# EAGLE design pulseandbloom (EAGLE 7.6.0)
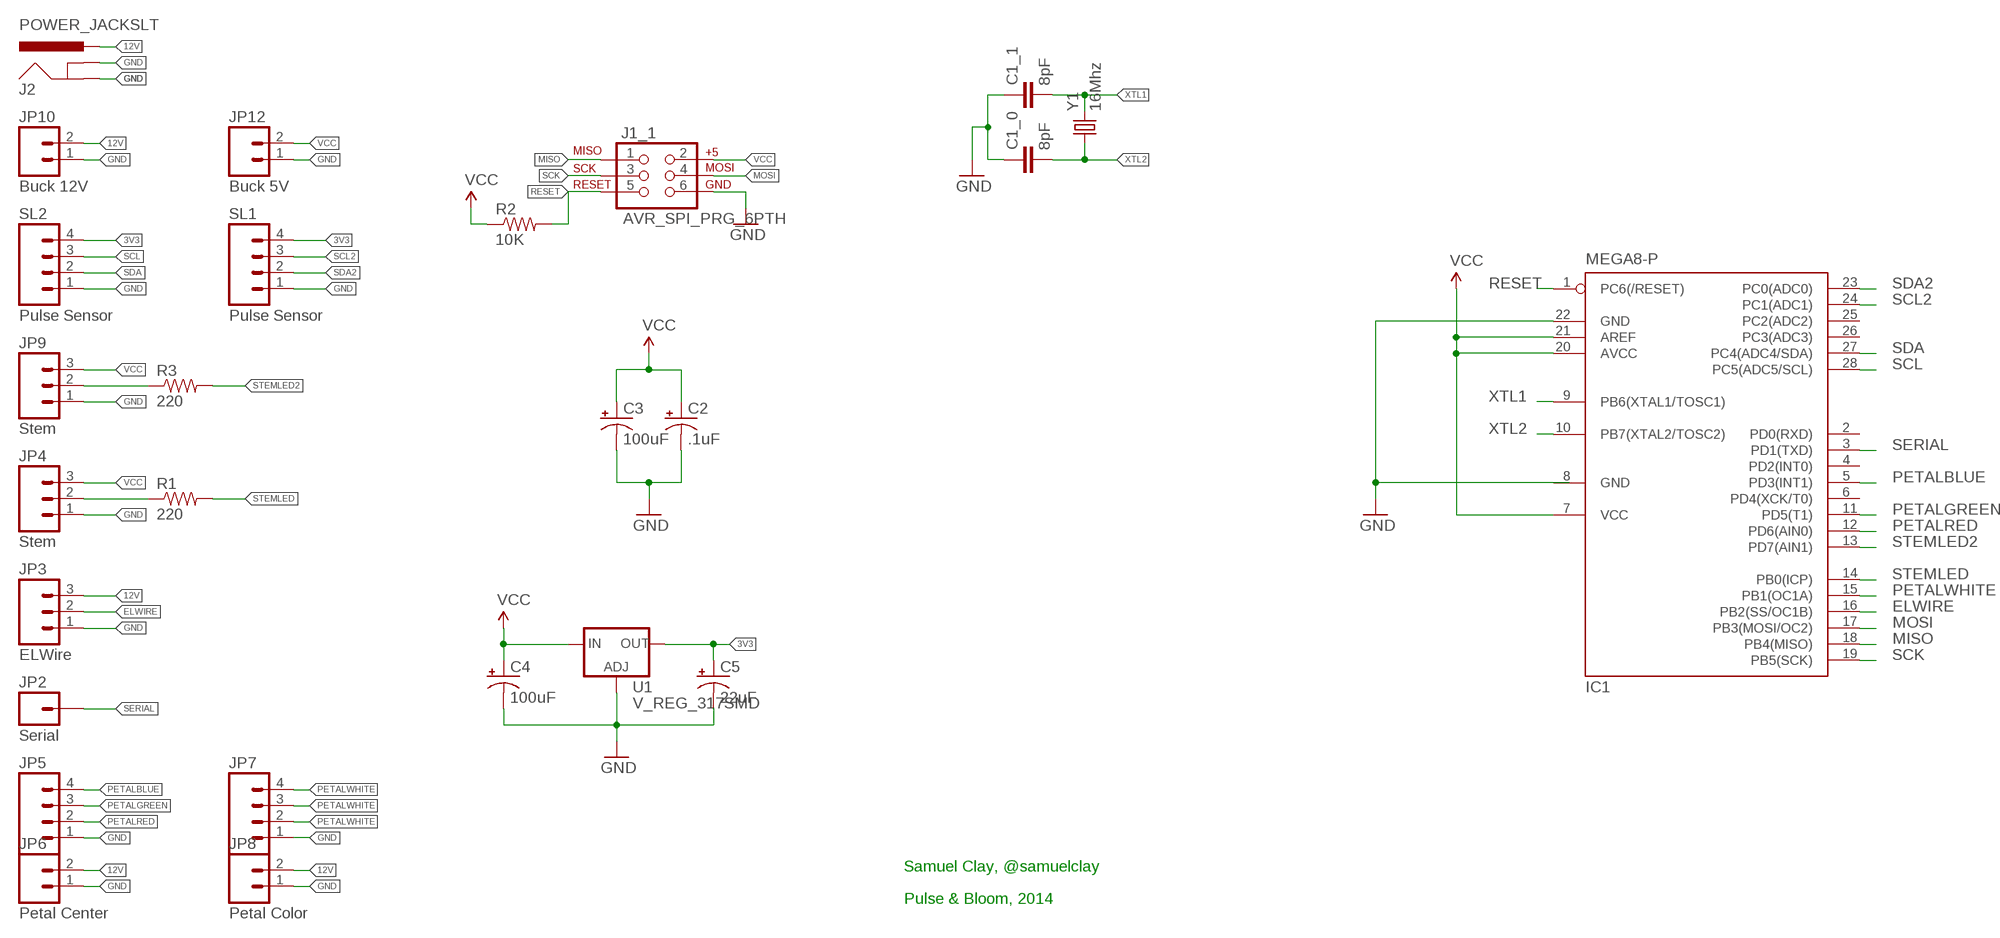
[diagram p0: schematic, sheet 1]

## Parts
C1_0  8pF  CAPPTH1  [CAP-PTH-5MM]
C1_1  8pF  CAPPTH1  [CAP-PTH-5MM]
C2  .1uF  CAP_POLPTH2  [CPOL-RADIAL-10UF-25V]
C3  100uF  CAP_POLPTH1  [CPOL-RADIAL-100UF-25V]
C4  100uF  CAP_POLPTH1  [CPOL-RADIAL-100UF-25V]
C5  22uF  CAP_POLPTH1  [CPOL-RADIAL-100UF-25V]
IC1  MEGA8-P  [DIL28-3]
J1_1  AVR_SPI_PRG_6PTH  [2X3]
J2  POWER_JACKSLT  [POWER_JACK_SLOT]
JP2  Serial  M01PTH  [1X01]
JP3  ELWire  M03POLAR_LOCK  [MOLEX-1X3_LOCK]
JP4  Stem  M03POLAR_LOCK  [MOLEX-1X3_LOCK]
JP5  M04POLAR_LOCK  [MOLEX-1X4_LOCK]
JP6  Petal Center  M023.5MM_LOCK  [SCREWTERMINAL-3.5MM-2_LOCK]
JP7  M04POLAR  [MOLEX-1X4]
JP8  Petal Color  M023.5MM_LOCK  [SCREWTERMINAL-3.5MM-2_LOCK]
JP9  Stem  M03POLAR_LOCK  [MOLEX-1X3_LOCK]
JP10  Buck 12V  M023.5MM_LOCK  [SCREWTERMINAL-3.5MM-2_LOCK]
JP12  Buck 5V  M023.5MM_LOCK  [SCREWTERMINAL-3.5MM-2_LOCK]
R1  220  RESISTORPTH-1/4W  [AXIAL-0.4]
R2  10K  RESISTORPTH-1/4W  [AXIAL-0.4]
R3  220  RESISTORPTH-1/4W  [AXIAL-0.4]
SL1  Pulse Sensor  M04POLAR_LOCK  [MOLEX-1X4_LOCK]
SL2  Pulse Sensor  M04POLAR_LOCK  [MOLEX-1X4_LOCK]
U1  V_REG_317SMD  [SOT223]
Y1  16Mhz  CRYSTALHC49US  [HC49US]

## Nets
3V3: C5.1(+) SL1.4 SL2.4 U1.2(OUT)
12V: J2.PWR JP3.3 JP6.2 JP8.2 JP10.2
ELWIRE: IC1.16(PB2(SS/OC1B)) JP3.2
GND: C1_0.1 C1_1.1 C2.2(-) C3.2(-) C4.2(-) C5.2(-) IC1.22(GND) J1_1.6 J2.GND@1(GNDBREAK) J2.GND@2(GND) JP3.1 JP4.1 JP5.1 JP6.1 JP7.1 JP8.1 JP9.1 JP10.1 JP12.1 SL1.1 SL2.1 U1.1(ADJ)
MISO: IC1.18(PB4(MISO)) J1_1.1
MOSI: IC1.17(PB3(MOSI/OC2)) J1_1.4
N$1: JP9.2 R3.P$1
N$7: JP4.2 R1.P$1
PETALBLUE: IC1.5(PD3(INT1)) JP5.4
PETALGREEN: IC1.11(PD5(T1)) JP5.3
PETALRED: IC1.12(PD6(AIN0)) JP5.2
PETALWHITE: IC1.15(PB1(OC1A)) JP7.2 JP7.3 JP7.4
RESET: IC1.1(PC6(/RESET)) J1_1.5 R2.P$2
SCK: IC1.19(PB5(SCK)) J1_1.3
SCL: IC1.28(PC5(ADC5/SCL)) SL2.3
SCL2: IC1.24(PC1(ADC1)) SL1.3
SDA: IC1.27(PC4(ADC4/SDA)) SL2.2
SDA2: IC1.23(PC0(ADC0)) SL1.2
SERIAL: IC1.3(PD1(TXD)) JP2.1
STEMLED: IC1.14(PB0(ICP)) R1.P$2
STEMLED2: IC1.13(PD7(AIN1)) R3.P$2
VCC: C2.1(+) C3.1(+) C4.1(+) IC1.7(VCC) IC1.20(AVCC) IC1.21(AREF) J1_1.2 JP4.3 JP9.3 JP12.2 R2.P$1 U1.3(IN)
XTL1: C1_1.2 IC1.9(PB6(XTAL1/TOSC1)) Y1.2
XTL2: C1_0.2 IC1.10(PB7(XTAL2/TOSC2)) Y1.1
Unconnected: IC1.2(PD0(RXD)) IC1.4(PD2(INT0)) IC1.6(PD4(XCK/T0)) IC1.25(PC2(ADC2)) IC1.26(PC3(ADC3))

## Notes on the sheet
- Samuel Clay, @samuelclay
- Pulse & Bloom, 2014

## Power pins joined to a net without a drawn wire
GND: IC1.8(GND)

## Library data of the parts
C1_0 C1_1 = SparkFun-Capacitors:CAP: Capacitor Standard 0603 ceramic capacitor, and 0.1" leaded capacitor.
C2-C5 = SparkFun-Capacitors:CAP_POL: Capacitor Polarized These are standard SMD and PTH capacitors. Normally 10uF, 47uF, and 100uF in electrolytic and tantalum varieties. Always verify the external diameter of the through hole cap, it varies with capacity, voltage, and manufacturer. The EIA devices should be standard.
IC1 = atmel:MEGA8-P: MICROCONTROLLER 8 Kbytes FLASH, 1 kbytes SRAM, 512 bytes EEPROM, USART, 4-channel 10 bit ADC, 2-channel 8 bit ADC Pin compatible with Atmega48, ATMega88, ATMega168 Source: avr.lbr; OC_FARNELL: unknown; OC_NEWARK: unknown
J1_1 = SparkFun-Connectors:AVR_SPI_PRG_6: AVR ISP 6 Pin This is the reduced ISP connector for AVR programming. Common on Arduino. This footprint will take up less PCB space and can be used with a 10-pin to 6-pin adapter such as SKU: BOB-08508 **Special note about "TEST_POINT" package. The stop mask is on the top side, so if you want your programming test points to be on the bottom of your board, make sure to place this package on the bottom side of the board. This also ensure that the orientation to program from the bottom side will be correct.
J2 = SparkFun-Connectors:POWER_JACK: Power Jack This is the standard 5.5mm barrel jack for power. The PTH is the most common, proven, reliable, footprint. The Slot footprint only works if the mill layer is transmitted to the PCB fab house so be warned. Mating wall wart : TOL-00298 (and others); PROD_ID: PRT-00119
JP2 = SparkFun-Connectors:M01: Header 1 Standard 1-pin 0.1" header. Use with straight break away headers (SKU : PRT-00116), right angle break away headers (PRT-00553), swiss pins (PRT-00743), machine pins (PRT-00117), and female headers (PRT-00115).
JP3 JP4 JP9 = SparkFun-Connectors:M03: Header 3 Standard 3-pin 0.1" header. Use with straight break away headers (SKU : PRT-00116), right angle break away headers (PRT-00553), swiss pins (PRT-00743), machine pins (PRT-00117), and female headers (PRT-00115). Molex polarized connector foot print use with SKU : PRT-08232 with associated crimp pins and housings.
JP5 JP7 SL1 SL2 = SparkFun-Connectors:M04: Header 4 Standard 4-pin 0.1" header. Use with straight break away headers (SKU : PRT-00116), right angle break away headers (PRT-00553), swiss pins (PRT-00743), machine pins (PRT-00117), and female headers (PRT-00115). Molex polarized connector foot print use with SKU : PRT-08231 with associated crimp pins and housings. 1MM SMD Version SKU: PRT-10208
JP6 JP8 JP10 JP12 = SparkFun-Connectors:M02: Standard 2-pin 0.1" header. Use with - straight break away headers ( PRT-00116) - right angle break away headers (PRT-00553) - swiss pins (PRT-00743) - machine pins (PRT-00117) - female headers (PRT-00115) Molex polarized connector foot print use with: PRT-08233 with associated crimp pins and housings. 2.54_SCREWTERM for use with PRT-10571. 3.5mm Screw Terminal footprints for PRT-08084 5mm Screw Terminal footprints for use with PRT-08433
R1-R3 = SparkFun-Passives:RESISTOR: Resistor Basic schematic elements and footprints for 0603, 1206, and PTH resistors.
U1 = SparkFun-PowerIC:V_REG_317: Voltage Regulator Standard LM317 adjustable voltage regulator. AOI (Adjust Output Input). Google 'LM317 Calculator' for easy to use app to get the two resistor values needed. 240/720 for 5V output. 240/390 for 3.3V output. Spark Fun Electronics SKU : COM-00527
Y1 = SparkFun-FreqCtrl:CRYSTAL: Various standard crystals. Proven footprints.

## Board
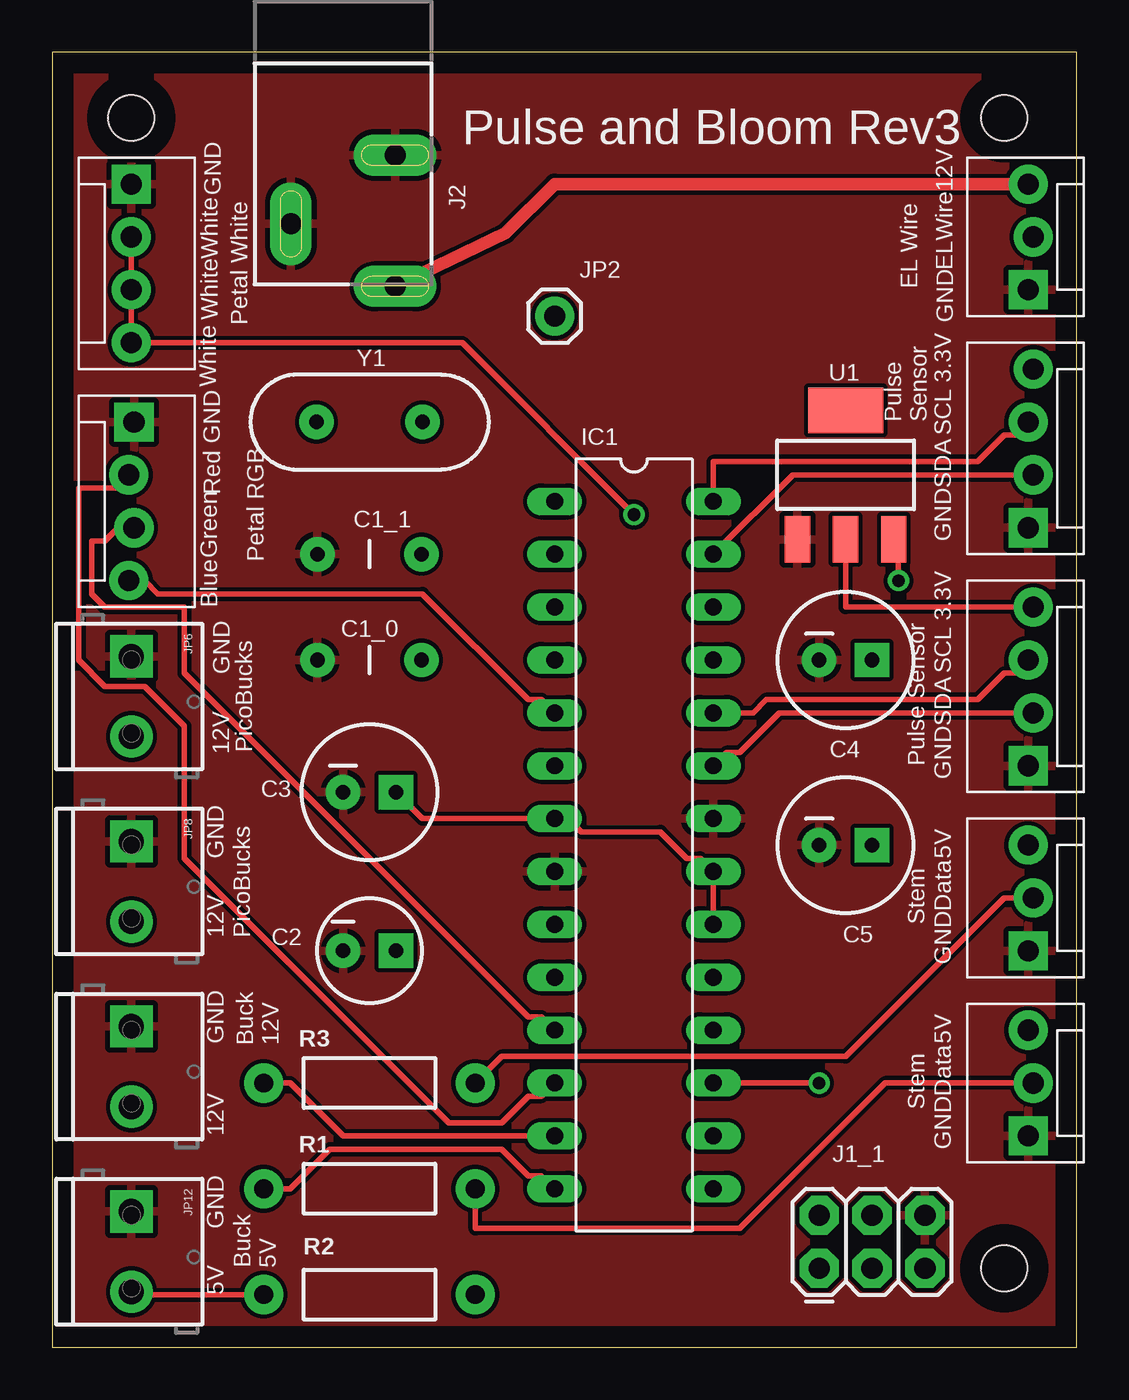
[diagram p1: board, top side]
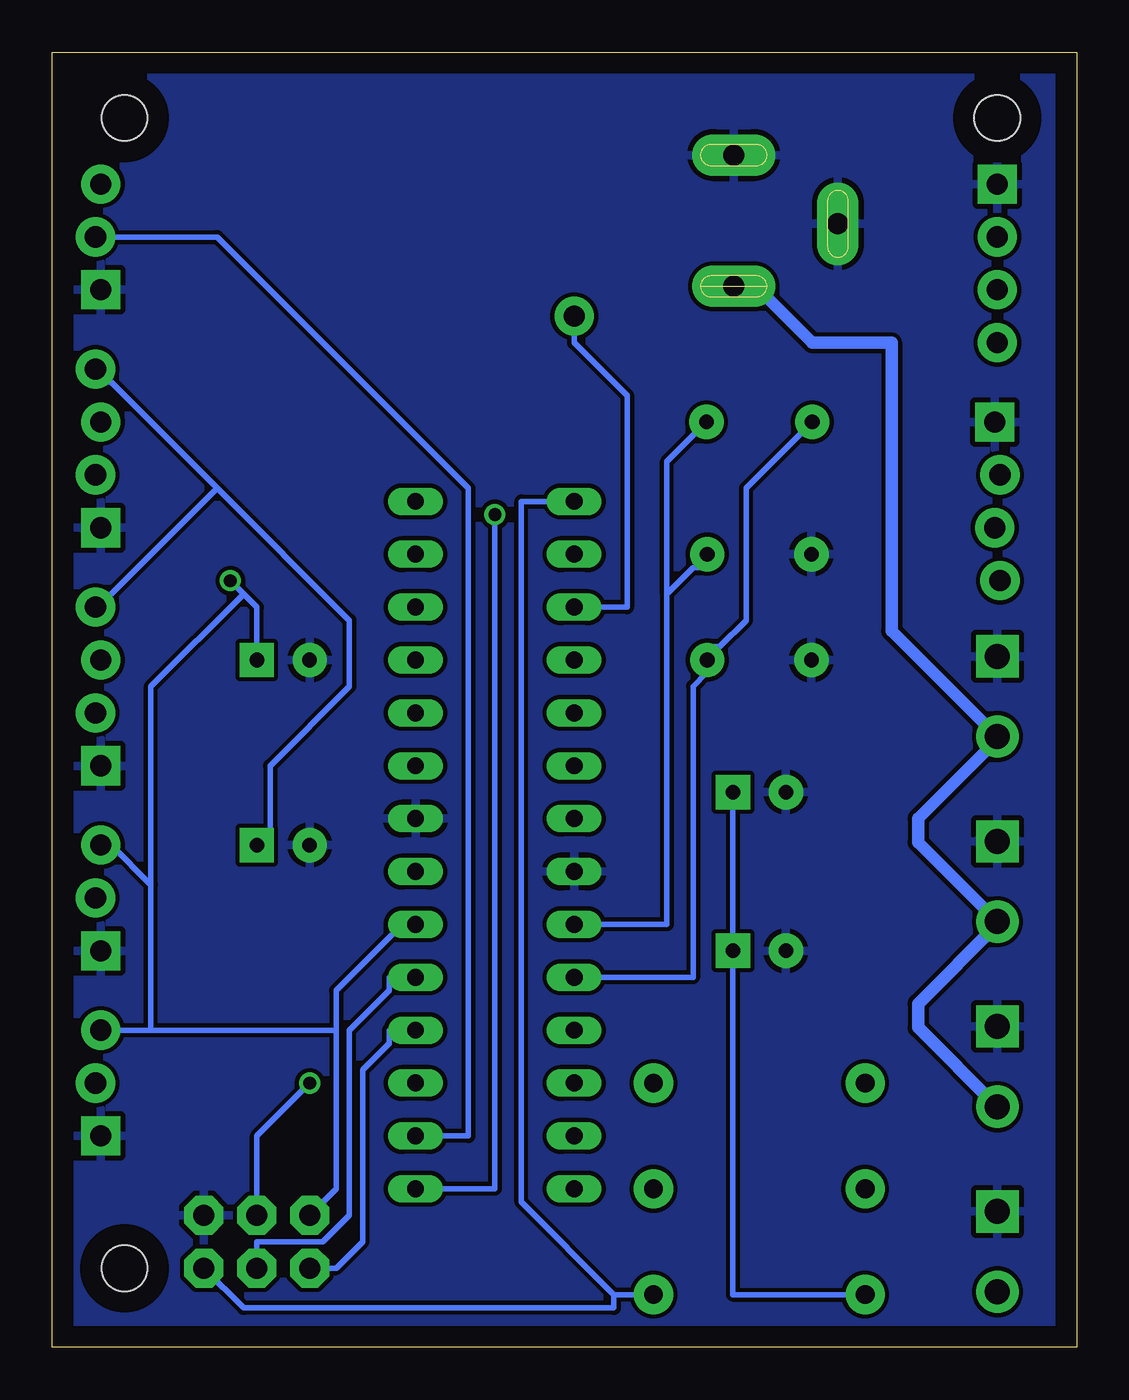
[diagram p2: board, bottom side, seen from below]

Size 49.2 x 62.22 mm. Coordinates in mm from the lower left corner, seen from the top.
Outline: 0,0 49.2,0 49.2,62.22 0,62.22 0,0
Copper layers (1*16): Top 0.035mm / dielectric 1.5mm / Bottom 0.035mm
Design rules "default": minimum track width 10mil, minimum drill 24mil, track to track 8mil, track to pad 8mil, pad to pad 8mil, via to via 8mil, smd to smd 8mil, copper to edge 40mil, drill to drill 8mil, minimum pad ring 10mil, minimum via ring 8mil, stop-mask expansion 4mil, vias tented up to drill 0mil, thermal gap 10mil
Holes 2.2 mm at 45.72,3.81 3.81,59.05 45.72,59.05

### Footprints (pad centres in the part's own frame; a part is rotated, then mirrored left to right if it is on the bottom)
CAP-PTH-5MM = drill 0.7 pad 1.651: 1 -2.5,0; 2 2.5,0
CPOL-RADIAL-10UF-25V = drill 0.7 pad 1.651 square: 1 1.27,0 | drill 0.7 pad 1.651: 2 -1.27,0
CPOL-RADIAL-100UF-25V = drill 0.7 pad 1.651 square: 1 1.27,0 | drill 0.7 pad 1.651: 2 -1.27,0
DIL28-3 = drill 0.813 long: 1 -16.51,-3.81; 2 -13.97,-3.81; 3 -11.43,-3.81; 4 -8.89,-3.81; 5 -6.35,-3.81; 6 -3.81,-3.81; 7 -1.27,-3.81; 8 1.27,-3.81; 9 3.81,-3.81; 10 6.35,-3.81; 11 8.89,-3.81; 12 11.43,-3.81; 13 13.97,-3.81; 14 16.51,-3.81; 15 16.51,3.81; 16 13.97,3.81; 17 11.43,3.81; 18 8.89,3.81; 19 6.35,3.81; 20 3.81,3.81; 21 1.27,3.81; 22 -1.27,3.81; 23 -3.81,3.81; 24 -6.35,3.81; 25 -8.89,3.81; 26 -11.43,3.81; 27 -13.97,3.81; 28 -16.51,3.81
2X3 = drill 1.016 pad 1.88 octagon: 1 0,0; 2 0,2.54; 3 2.54,0; 4 2.54,2.54; 5 5.08,0; 6 5.08,2.54
POWER_JACK_SLOT = drill 1 pad 2 long: GND@1 2.58,7.5; GND@2 7.58,10.8; PWR 2.58,13.8
1X01 = drill 1.016 pad 1.88: 1 0,0
MOLEX-1X3_LOCK = drill 1.016 pad 1.88 square: 1 0,0.127 | drill 1.016 pad 1.88: 2 2.54,-0.127; 3 5.08,0.127
MOLEX-1X4_LOCK = drill 1.016 pad 1.88 square: 1 0,0.127 | drill 1.016 pad 1.88: 2 2.54,-0.127; 3 5.08,0.127; 4 7.62,-0.127
SCREWTERMINAL-3.5MM-2_LOCK = drill 1.2 pad 2.032 square: 1 -0.178,0 | drill 1.2 pad 2.032: 2 3.678,0
MOLEX-1X4 = drill 1.016 pad 1.88 square: 1 0,0 | drill 1.016 pad 1.88: 2 2.54,0; 3 5.08,0; 4 7.62,0
AXIAL-0.4 = drill 0.9 pad 1.88: P$1 -5.08,0; P$2 5.08,0
SOT223 = smd 1.219 x 2.235: 1 -2.311,-3.099; 2 0,-3.099; 3 2.311,-3.099 | smd 3.6 x 2.2: 4 0,3.099
HC49US = drill 0.7 pad 1.651: 1 -2.54,0; 2 2.54,0

### Placement (x,y rotation side)
C1_0  15.24,33.02 0 top
C1_1  15.24,38.1 0 top
C2  15.24,19.05 0 top
C3  15.24,26.67 0 top
C4  38.1,33.02 0 top
C5  38.1,24.13 0 top
IC1  27.94,24.13 270 top
J1_1  36.83,3.81 0 top
J2  19.05,64.77 180 top
JP2  24.13,49.53 0 top
JP3  46.99,50.8 90 top
JP4  46.99,10.16 90 top
JP5  3.81,44.45 270 top
JP6  3.81,33.02 270 top
JP7  3.81,55.88 270 top
JP8  3.81,24.13 270 top
JP9  46.99,19.05 90 top
JP10  3.81,15.24 270 top
JP12  3.81,6.35 270 top
R1  15.24,7.62 180 top
R2  15.24,2.54 0 top
R3  15.24,12.7 180 top
SL1  46.99,27.94 90 top
SL2  46.99,39.37 90 top
U1  38.1,41.91 0 top
Y1  15.24,44.45 0 top

### Tracks (layer width: path | path; a pad name or v marks a point on that pad's centre or on a via)
3V3
  Top 0.254: U1.2 38.1,35.56 SL1.4
  Bottom 0.254: C5.1 38.73,24.77 38.73,27.94 34.92,31.75 34.92,34.92 41.27,41.27 | 41.27,41.27 46.35,46.35 46.99,46.35 46.99,46.99 SL2.4 | 41.27,41.27 46.99,35.56 SL1.4
12V
  Top 0.61: J2.PWR 21.76,53.51 24.13,55.88 JP3.3
  Bottom 0.61: JP10.2 7.62,15.37 7.62,16.51 3.81,20.32 JP8.2 7.62,24.26 7.62,25.4 3.81,29.21 JP6.2 8.89,34.42 8.89,48.26 12.7,48.26 15.41,50.97 J2.PWR
ELWIRE
  Bottom 0.254: IC1.16 29.21,10.16 29.21,41.27 41.27,53.34 JP3.2
GND
  pour Bottom: -7.32,68.76 54.68,68.76 54.68,67.76 54.68,-6.24 -6.32,-6.24 -6.32,-5.24 -7.32,-5.24
  pour Top: -3.32,66.76 52.68,66.76 52.68,61.76 52.68,-4.24 -3.32,-4.24 -3.32,-3.24
MISO
  Bottom 0.254: IC1.18 33.02,15.24 33.02,14.6 34.29,13.33 34.29,5.08 35.56,3.81 J1_1.1
MOSI  (via drill 0.61)
  Top 0.254: v36.83,12.7 IC1.17
  Bottom 0.254: v36.83,12.7 39.37,10.16 J1_1.4
N$1
  Top 0.254: R3.P$1 21.59,13.97 38.1,13.97 45.72,21.59 JP9.2
N$7
  Top 0.254: R1.P$1 20.32,5.71 33.02,5.71 40.01,12.7 JP4.2
PETALBLUE
  Top 0.254: IC1.5 23.49,31.11 22.86,31.11 17.78,36.2 5.08,36.2 4.45,36.83 JP5.4
PETALGREEN
  Top 0.254: IC1.11 23.49,15.87 22.86,15.87 6.35,32.38 6.35,35.56 2.54,35.56 1.91,36.2 1.91,38.73 2.54,38.73 3.18,39.37 JP5.3
PETALRED
  Top 0.254: IC1.12 23.49,12.06 22.86,12.06 21.59,10.79 19.05,10.79 6.35,23.49 6.35,29.84 4.45,31.75 2.54,31.75 1.27,33.02 1.27,41.27 3.18,41.27 3.81,41.91 JP5.2
PETALWHITE  (via drill 0.61)
  Top 0.254: JP7.2 JP7.3 JP7.4 19.69,48.26 v27.94,40
  Bottom 0.254: IC1.15 27.94,7.62 v27.94,40
RESET
  Bottom 0.254: IC1.1 26.67,40.64 26.67,6.99 22.23,2.54 | R2.P$2 22.23,2.54 | J1_1.5 40.01,1.9 22.23,1.9 22.23,2.54
SCK
  Bottom 0.254: IC1.19 33.02,17.78 33.02,17.14 34.92,15.24 34.92,6.35 36.2,5.08 39.37,5.08 J1_1.3
SCL
  Top 0.254: IC1.28 31.75,42.54 44.45,42.54 45.72,43.81 46.35,43.81 46.99,44.45 SL2.3
SCL2
  Top 0.254: IC1.24 33.66,30.48 34.29,31.11 44.45,31.11 45.72,32.38 46.35,32.38 46.99,33.02 SL1.3
SDA
  Top 0.254: IC1.27 35.56,41.91 SL2.2
SDA2
  Top 0.254: IC1.23 32.38,28.57 33.02,28.57 34.92,30.48 SL1.2
SERIAL
  Bottom 0.254: IC1.3 21.59,35.56 21.59,45.72 24.13,48.26 JP2.1
STEMLED
  Top 0.254: IC1.14 23.49,8.26 22.86,8.26 21.59,9.53 13.34,9.53 11.43,7.62 R1.P$2
STEMLED2
  Top 0.254: IC1.13 13.97,10.16 11.43,12.7 R3.P$2
VCC  (via drill 0.61)
  Top 0.254: R2.P$1 3.81,2.54 JP12.2 | v40.64,36.83 40.64,38.73 U1.3 | IC1.20 IC1.21 31.12,23.49 30.48,23.49 29.21,24.77 25.4,24.77 24.77,25.4 IC1.7 17.78,25.4 C3.1
  Bottom 0.254: 40.01,36.2 39.37,35.56 C4.1 | 40.01,36.2 v40.64,36.83 | C3.1 C2.1 16.51,2.54 R2.P$1 | J1_1.2 35.56,7.62 35.56,15.24 | 35.56,15.24 35.56,17.14 32.38,20.32 IC1.20 | 35.56,15.24 44.45,15.24 | 44.45,15.24 JP4.3 | 44.45,22.23 46.35,24.13 JP9.3 | 44.45,15.24 44.45,22.23 | 40.01,36.2 44.45,31.75 44.45,22.23
XTL1
  Bottom 0.254: IC1.9 19.69,20.32 19.69,36.2 | 19.69,36.2 18.41,37.46 17.78,37.46 17.78,38.1 C1_1.2 | Y1.2 19.69,42.54 19.69,36.2
XTL2
  Bottom 0.254: IC1.10 18.41,17.78 18.41,31.75 17.78,32.38 17.78,33.02 | Y1.1 15.88,41.27 15.88,34.92 17.15,33.66 17.78,33.66 17.78,33.02 | 17.78,33.02 C1_0.2

### Text on the board
tPlace: Pulse and Bloom Rev3 | GND | 12V | White | ELWire | EL Wire | White | Petal White | GND | 3.3V | White | Pulse / Sensor | GND | SCL | SDA | Red | GND | Green | Petal RGB | Blue | 3.3V | GND | SCL | SDA | 12V | PicoBucks | Pulse Sensor | GND | GND | 5V | Stem | Data | 12V | PicoBucks | GND | GND | Buck / 12V | 5V | Stem | Data | 12V | GND | GND | Buck / 5V | 5V